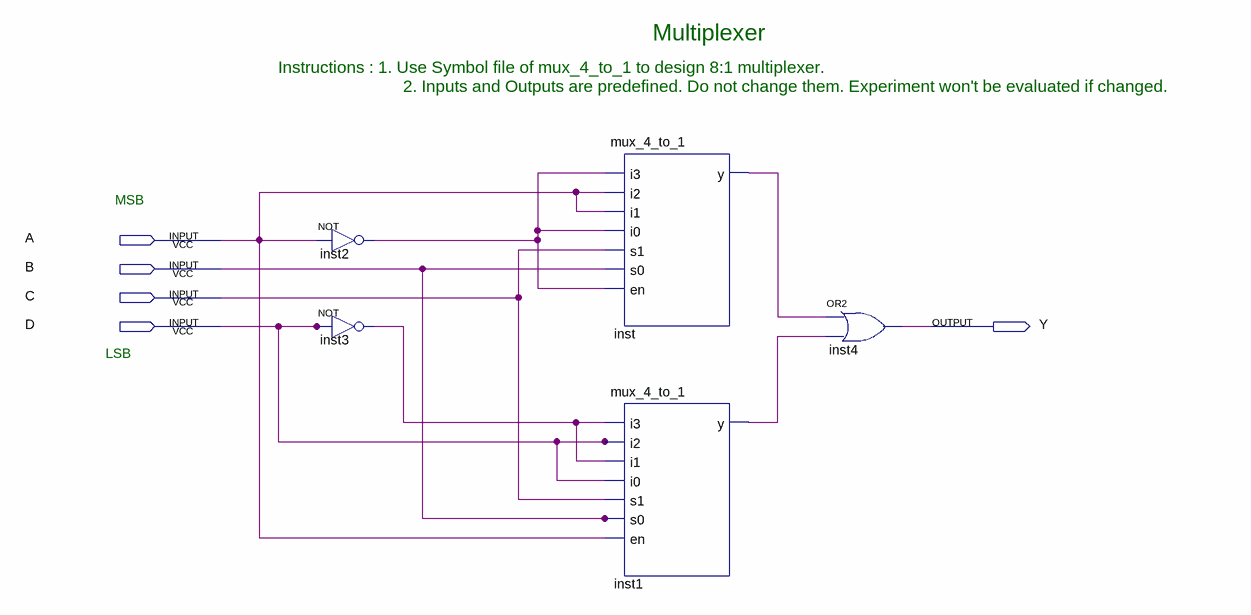
[diagram p0: schematic sheet]
// Quartus schematic mux_8_to_1.bdf as structural Verilog: 5 symbols, 5 pins
module mux_8_to_1 (
  input  A,
  input  B,
  input  C,
  input  D,
  output Y
);

  wire inst1_y, inst2_out, inst3_out, inst_y;

  not inst2 (inst2_out, A);
  not inst3 (inst3_out, D);
  mux_4_to_1 inst (.i3(inst2_out), .i2(A), .i1(A), .i0(inst2_out), .s1(C), .s0(B), .en(inst2_out), .y(inst_y));
  mux_4_to_1 inst1 (.i3(inst3_out), .i2(D), .i1(inst3_out), .i0(D), .s1(C), .s0(B), .en(A), .y(inst1_y));
  or inst4 (Y, inst_y, inst1_y);

  // Notes on the sheet:
  //   Multiplexer
  //   Instructions : 1. Use Symbol file of mux_4_to_1 to design 8:1 multiplexer. 
  //   2. Inputs and Outputs are predefined. Do not change them. Experiment won't be evaluated if changed.
  //   MSB
  //   LSB
endmodule
